# EAGLE design ardio_st32f205r (EAGLE 5.11)
MFR: Abracon; MFR_PART: ABLS-25.000MHZ-B4-F-T

## Sheet 1 of 3
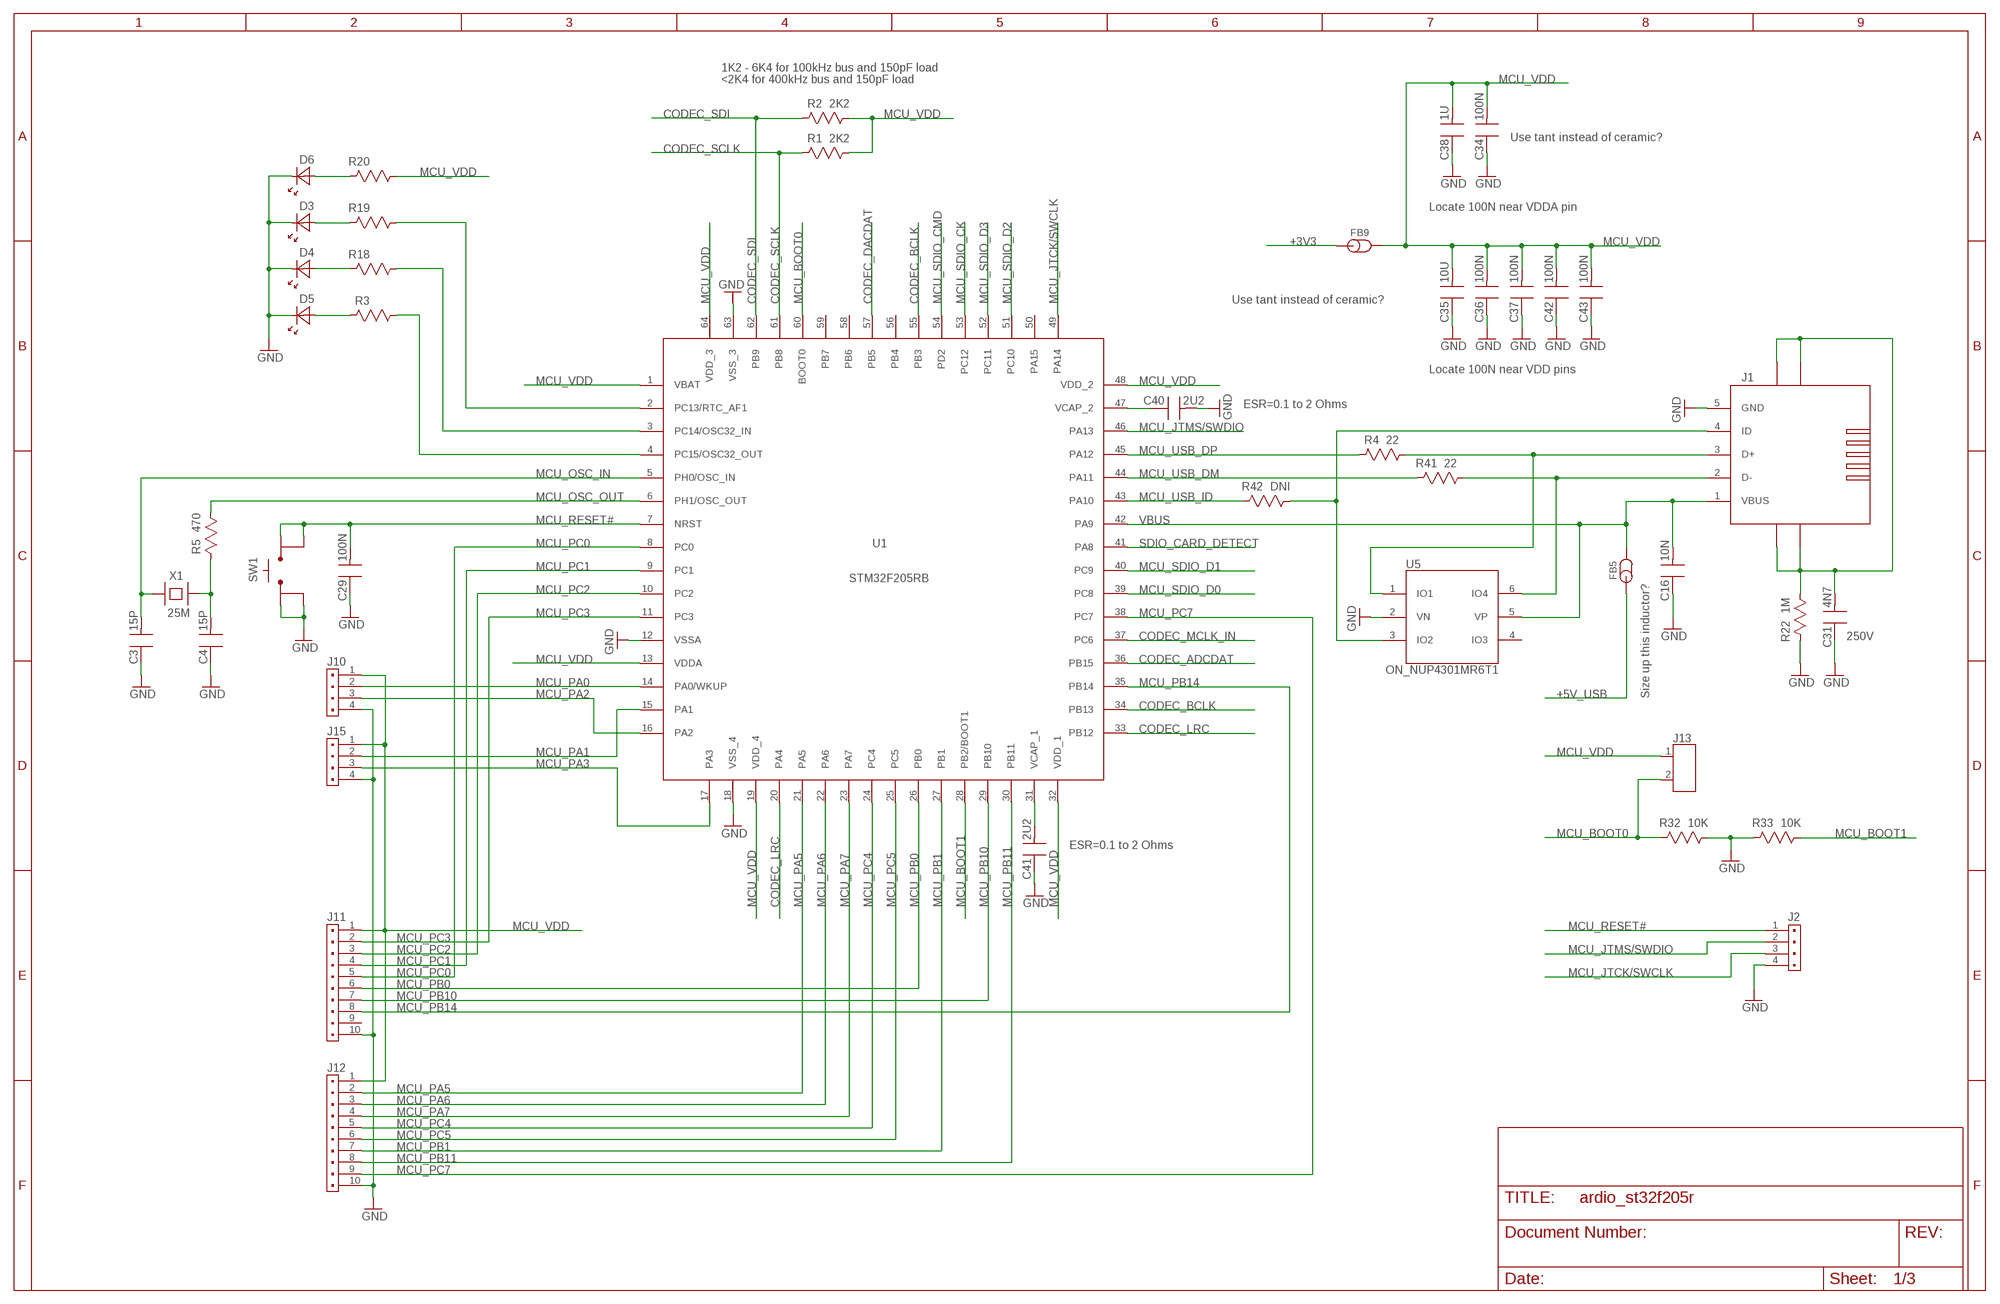
[diagram p0: schematic, sheet 1]

### Parts
C3  15P  C0603_90  [CAPC1608X90N]
C4  15P  C0603_90  [CAPC1608X90N]
C16  10N  C0603_90  [CAPC1608X90N]
C29  100N  C0603_90  [CAPC1608X90N]
C31  4N7  C0603_90  [CAPC1608X90N]
C34  100N  C0603_90  [CAPC1608X90N]
C35  10U  C0805_135  [CAPC2012X135N]
C36  100N  C0603_90  [CAPC1608X90N]
C37  100N  C0603_90  [CAPC1608X90N]
C38  1U  C0603_90  [CAPC1608X90N]
C40  2U2  C0805_135  [CAPC2012X135N]
C41  2U2  C0805_135  [CAPC2012X135N]
C42  100N  C0603_90  [CAPC1608X90N]
C43  100N  C0603_90  [CAPC1608X90N]
D3  LED_0603  [LEDC1608X80N]
D4  LED_0603  [LEDC1608X80N]
D5  LED_0603  [LEDC1608X80N]
D6  LED_0603  [LEDC1608X80N]
FB5  FB0603  [INDC1608X95N]
FB9  FB0603  [INDC1608X95N]
J1  USB_MINI_B_HIROSE_UX60_MB_5ST  [HIROSE_UX60_MB_5ST]
J2  HEADER1X4  HEADER1X4TH-254  [HEADER254P1X4]
J10  HEADER1X4TH-254  [HEADER254P1X4]
J11  HEADER1X10TH-254  [HEADER254P1X10]
J12  HEADER1X10TH-254  [HEADER254P1X10]
J13  CON2_100MIL  CON2TH-254  [HEADER254P1X2]
J15  HEADER1X4TH-254  [HEADER254P1X4]
R1  2K2  R0603_55  [RESC1608X55N]
R2  2K2  R0603_55  [RESC1608X55N]
R3  R0603_55  [RESC1608X55N]
R4  22  R0603_55  [RESC1608X55N]
R5  470  R0603_55  [RESC1608X55N]
R18  R0603_55  [RESC1608X55N]
R19  R0603_55  [RESC1608X55N]
R20  R0603_55  [RESC1608X55N]
R22  1M  R0603_55  [RESC1608X55N]
R32  10K  R0603_55  [RESC1608X55N]
R33  10K  R0603_55  [RESC1608X55N]
R41  22  R0603_55  [RESC1608X55N]
R42  DNI  R0603_55  [RESC1608X55N]
SW1  SPST_NO_4PIN  [6X6_SMD]
U1  STM32F205RB  [QFP50P1200X1200X160-64N]
U5  ON_NUP4301MR6T1  [SOP95P275X110-6N]
X1  25M  X_HC49US  [HC-49/U-S]

### Nets
+3V3: FB9.1 ; also sheet 2,3
+5V_USB: FB5.1 ; also sheet 2
CODEC_ADCDAT: U1.36(PB15) ; also sheet 3
CODEC_BCLK: U1.34(PB13) U1.55(PB3) ; also sheet 3
CODEC_DACDAT: U1.57(PB5) ; also sheet 3
CODEC_LRC: U1.20(PA4) U1.33(PB12) ; also sheet 3
CODEC_MCLK_IN: U1.37(PC6) ; also sheet 3
CODEC_SCLK: R1.1 U1.61(PB8) ; also sheet 3
CODEC_SDI: R2.1 U1.62(PB9) ; also sheet 3
GND: C3.1 C4.1 C16.1 C29.1 C31.1 C34.1 C35.1 C36.1 C37.1 C38.1 C40.2 C41.1 C42.1 C43.1 D3.C D4.C D5.C D6.C J1.5(GND) J2.4 J10.4 J11.10 J12.10 J15.4 R22.1 R32.2 R33.1 SW1.1 SW1.2 U1.12(VSSA) U1.18(VSS_4) U1.63(VSS_3) U5.2(VN) ; also sheet 2,3
MCU_BOOT0: J13.2 R32.1 U1.60(BOOT0)
MCU_BOOT1: R33.2 U1.28(PB2/BOOT1)
MCU_JTCK/SWCLK: J2.3 U1.49(PA14)
MCU_JTMS/SWDIO: J2.2 U1.46(PA13)
MCU_OSC_IN: C3.2 U1.5(PH0/OSC_IN) X1.1
MCU_OSC_OUT: R5.2 U1.6(PH1/OSC_OUT)
MCU_PA0: J10.2 U1.14(PA0/WKUP)
MCU_PA1: J15.2 U1.15(PA1)
MCU_PA2: J10.3 U1.16(PA2)
MCU_PA3: J15.3 U1.17(PA3)
MCU_PA5: J12.2 U1.21(PA5)
MCU_PA6: J12.3 U1.22(PA6)
MCU_PA7: J12.4 U1.23(PA7)
MCU_PB0: J11.6 U1.26(PB0)
MCU_PB1: J12.7 U1.27(PB1)
MCU_PB10: J11.7 U1.29(PB10)
MCU_PB11: J12.8 U1.30(PB11)
MCU_PB14: J11.8 U1.35(PB14)
MCU_PC0: J11.5 U1.8(PC0)
MCU_PC1: J11.4 U1.9(PC1)
MCU_PC2: J11.3 U1.10(PC2)
MCU_PC3: J11.2 U1.11(PC3)
MCU_PC4: J12.5 U1.24(PC4)
MCU_PC5: J12.6 U1.25(PC5)
MCU_PC7: J12.9 U1.38(PC7)
MCU_RESET#: C29.2 J2.1 SW1.3 SW1.4 U1.7(NRST)
MCU_SDIO_CK: U1.53(PC12) ; also sheet 2
MCU_SDIO_CMD: U1.54(PD2) ; also sheet 2
MCU_SDIO_D0: U1.39(PC8) ; also sheet 2
MCU_SDIO_D1: U1.40(PC9) ; also sheet 2
MCU_SDIO_D2: U1.51(PC10) ; also sheet 2
MCU_SDIO_D3: U1.52(PC11) ; also sheet 2
MCU_USB_DM: R41.1 U1.44(PA11)
MCU_USB_DP: R4.1 U1.45(PA12)
MCU_USB_ID: R42.1 U1.43(PA10)
MCU_VDD: C34.2 C35.2 C36.2 C37.2 C38.2 C42.2 C43.2 FB9.2 J10.1 J11.1 J12.1 J13.1 J15.1 R1.2 R2.2 R20.2 U1.1(VBAT) U1.13(VDDA) U1.19(VDD_4) U1.32(VDD_1) U1.48(VDD_2) U1.64(VDD_3) ; also sheet 2
N$1: R3.2 U1.4(PC15/OSC32_OUT)
N$2: R18.2 U1.3(PC14/OSC32_IN)
N$3: R19.2 U1.2(PC13/RTC_AF1)
N$7: D3.A R19.1
N$10: C4.2 R5.1 X1.2
N$11: J1.2(D-) R41.2 U5.6(IO4)
N$13: D4.A R18.1
N$14: D5.A R3.1
N$15: J1.3(D+) R4.2 U5.1(IO1)
N$16: C40.1 U1.47(VCAP_2)
N$17: D6.A R20.1
N$23: C41.2 U1.31(VCAP_1)
SDIO_CARD_DETECT: U1.41(PA8) ; also sheet 2
USB_ID: J1.4(ID) R42.2 U5.3(IO2)
USB_SHIELD: C31.2 J1.SHIELD@1(SHIELD) J1.SHIELD@2(SHIELD) J1.SHIELD@3(SHIELD) J1.SHIELD@4(SHIELD) R22.2
VBUS: C16.2 FB5.2 J1.1(VBUS) U1.42(PA9) U5.5(VP)
Unconnected: J11.9 U1.50(PA15) U1.56(PB4) U1.58(PB6) U1.59(PB7) U5.4(IO3)

### Notes on the sheet
- 1K2 - 6K4 for 100kHz bus and 150pF load
- <2K4 for 400kHz bus and 150pF load
- Use tant instead of ceramic?
- Locate 100N near VDDA pin
- Use tant instead of ceramic?
- Locate 100N near VDD pins
- ESR=0.1 to 2 Ohms
- 250V
- Size up this inductor?
- ESR=0.1 to 2 Ohms

## Sheet 2 of 3
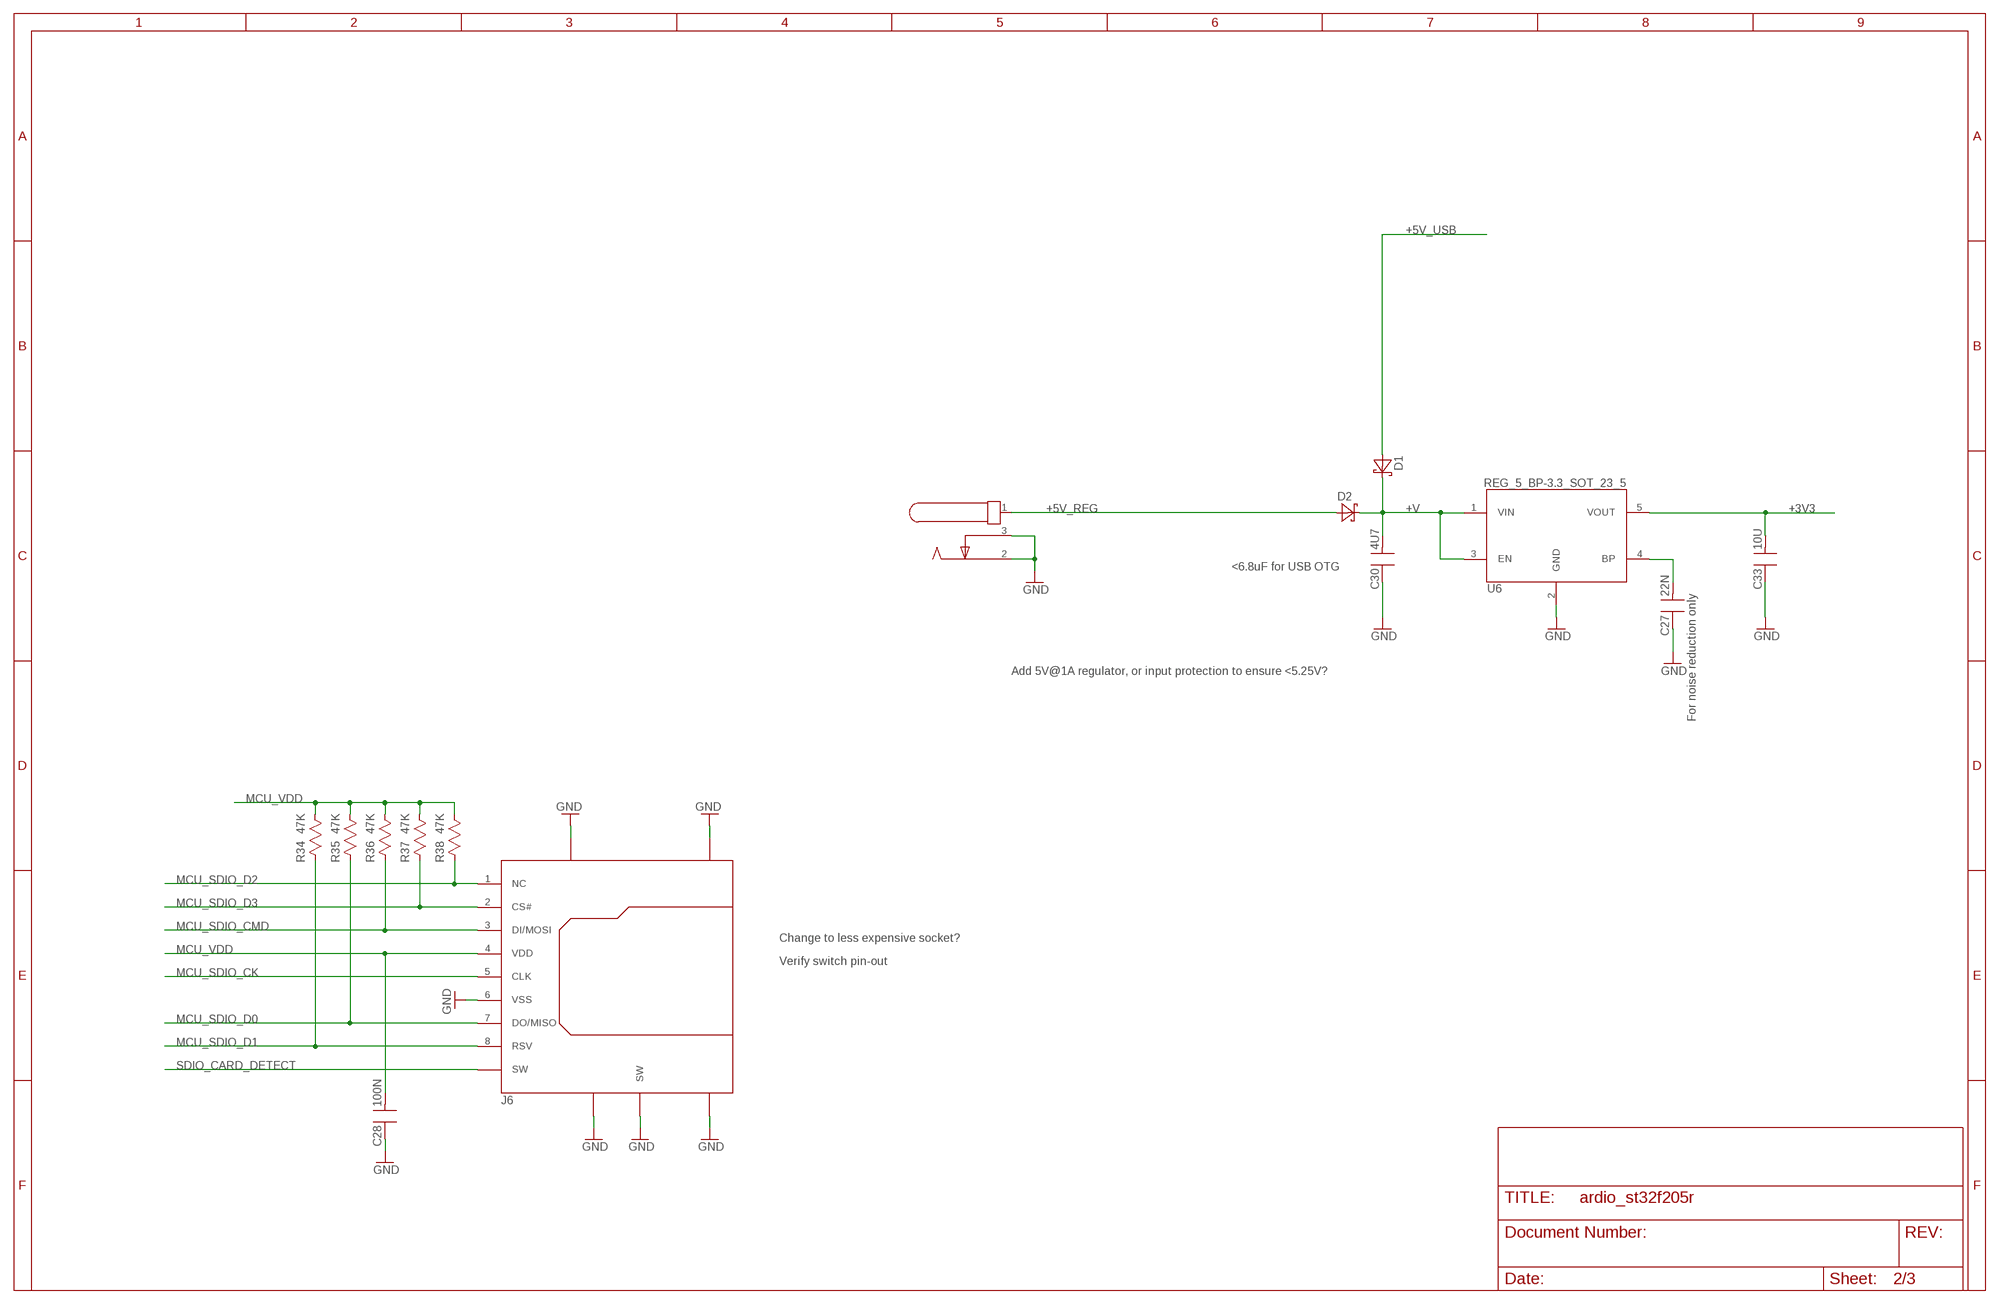
[diagram p1: schematic, sheet 2]

### Parts
C27  22N  C0603_90  [CAPC1608X90N]
C28  100N  C0603_90  [CAPC1608X90N]
C30  4U7  C0805_135  [CAPC2012X135N]
C33  10U  C0805_135  [CAPC2012X135N]
D1  SCHOTTKY_SMA  [DIOM5027X244N]
D2  SCHOTTKY_SMA  [DIOM5027X244N]
J6  MICROSD_SPI_DM3AT  [DM3AT]
J7  DC_3_CUI_PJ102A  [CUI_PJ_102A]
R34  47K  R0603_55  [RESC1608X55N]
R35  47K  R0603_55  [RESC1608X55N]
R36  47K  R0603_55  [RESC1608X55N]
R37  47K  R0603_55  [RESC1608X55N]
R38  47K  R0603_55  [RESC1608X55N]
U6  REG_5_BP-3.3_SOT_23_5  [SOT95P280X110-5N]

### Nets
+3V3: C33.2 U6.5(VOUT) ; also sheet 1,3
+5V_REG: D2.A J7.1
+5V_USB: D1.A ; also sheet 1
+V: C30.2 D1.C D2.C U6.1(VIN) U6.3(EN)
GND: C27.1 C28.1 C30.1 C33.1 J6.6(VSS) J6.SHIELD@1(SHIELD) J6.SHIELD@3(SHIELD) J6.SHIELD@4(SHIELD) J6.SHIELD@5(SHIELD) J6.SW@2(SW) J7.2 J7.3 U6.2(GND) ; also sheet 1,3
MCU_SDIO_CK: J6.5(CLK) ; also sheet 1
MCU_SDIO_CMD: J6.3(DI/MOSI) R36.1 ; also sheet 1
MCU_SDIO_D0: J6.7(DO/MISO) R35.1 ; also sheet 1
MCU_SDIO_D1: J6.8(RSV) R34.1 ; also sheet 1
MCU_SDIO_D2: J6.1(NC) R38.1 ; also sheet 1
MCU_SDIO_D3: J6.2(CS#) R37.1 ; also sheet 1
MCU_VDD: C28.2 J6.4(VDD) R34.2 R35.2 R36.2 R37.2 R38.2 ; also sheet 1
N$6: C27.2 U6.4(BP)
SDIO_CARD_DETECT: J6.SW@1(SW) ; also sheet 1

### Notes on the sheet
- <6.8uF for USB OTG
- Add 5V@1A regulator, or input protection to ensure <5.25V?
- For noise reduction only
- Change to less expensive socket?
- Verify switch pin-out

## Sheet 3 of 3
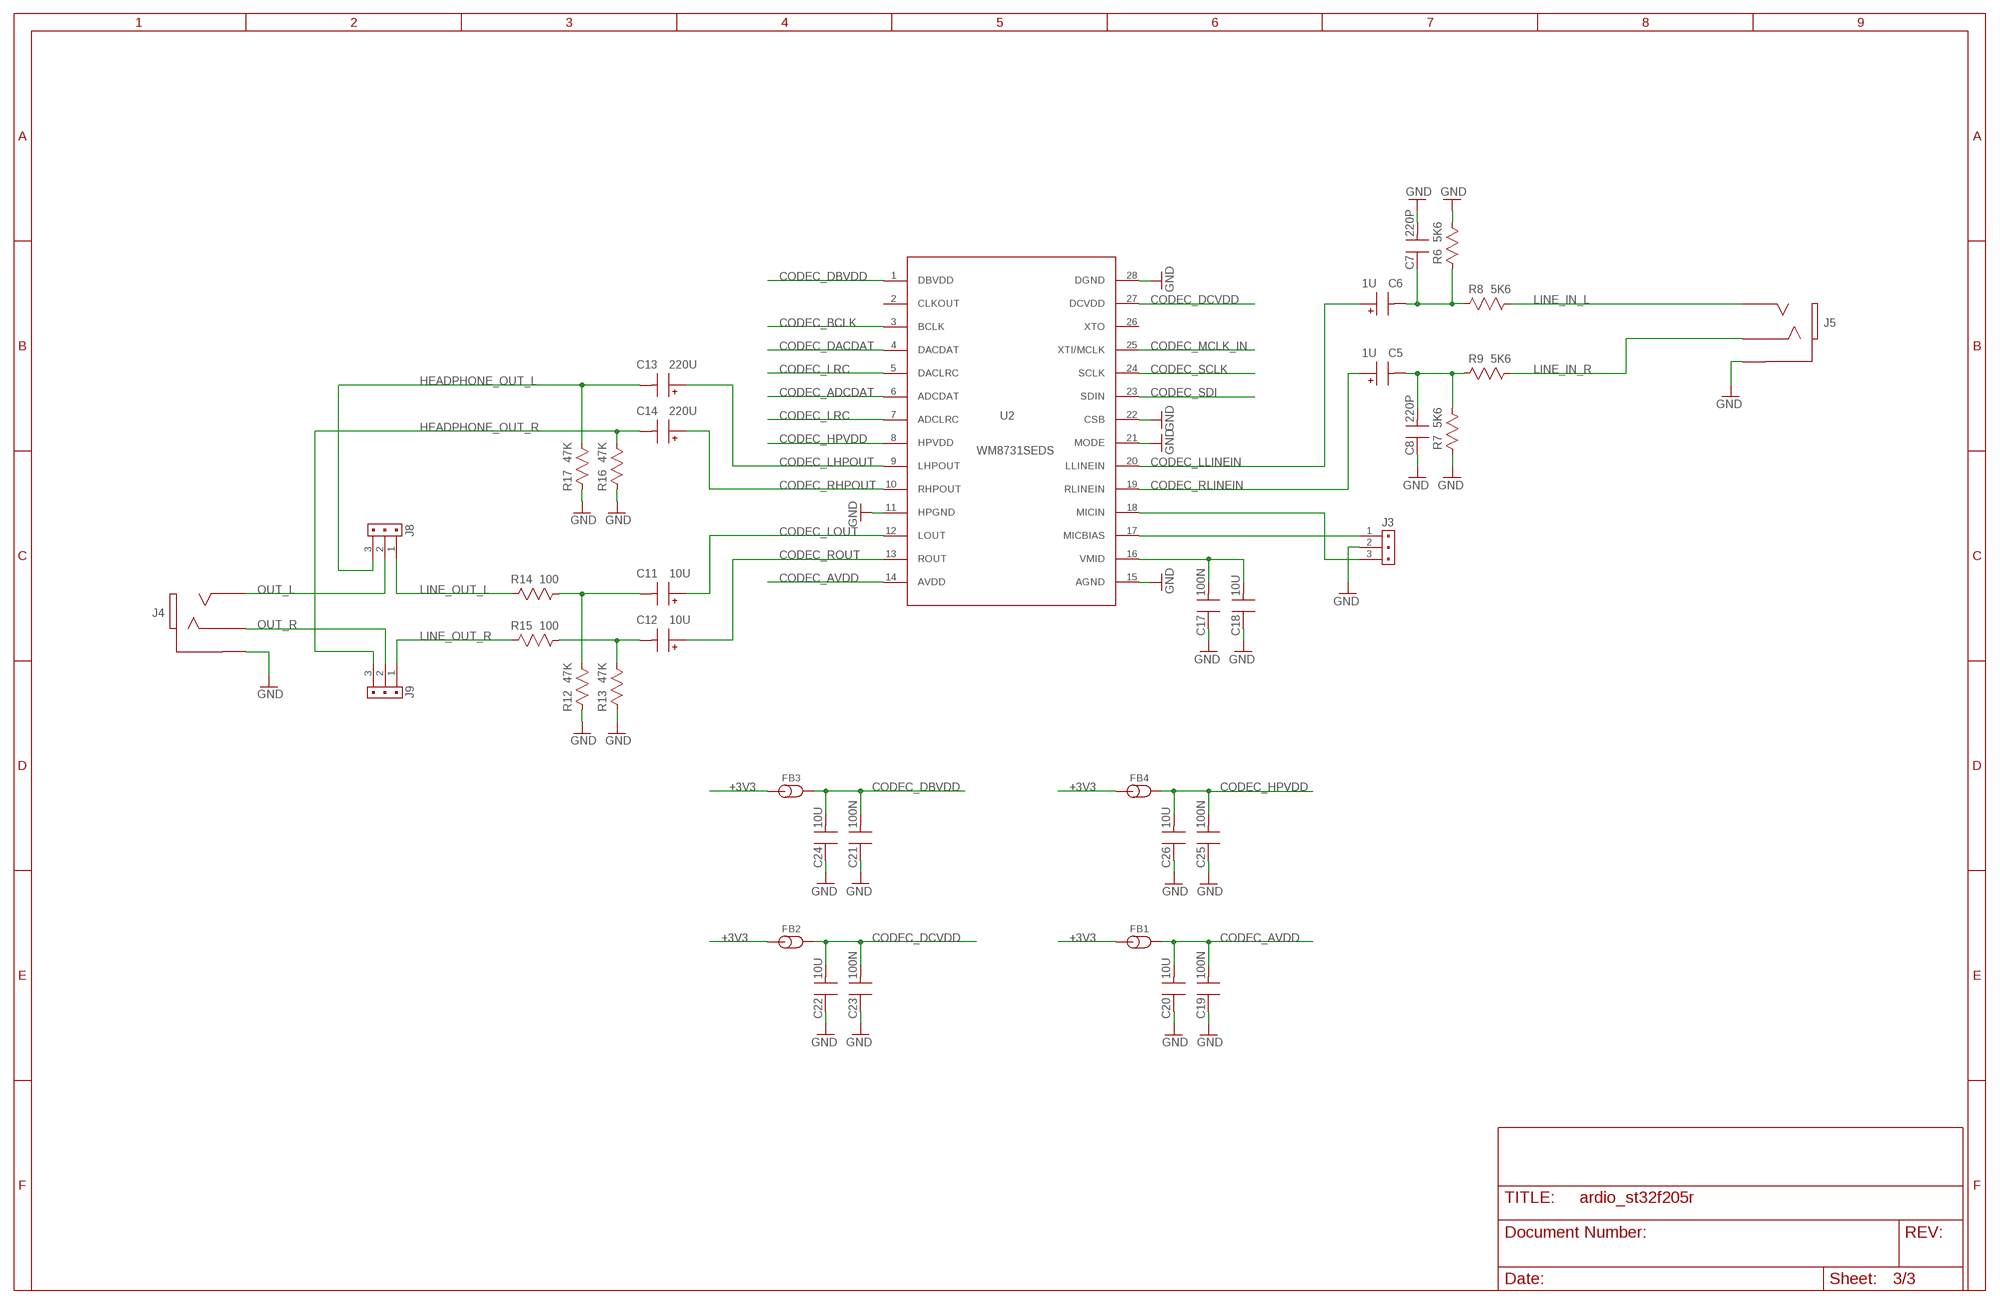
[diagram p2: schematic, sheet 3]

### Parts
C5  1U  CPOL_CASE_B  [CAPAE430X540N]
C6  1U  CPOL_CASE_B  [CAPAE430X540N]
C7  220P  C0603_90  [CAPC1608X90N]
C8  220P  C0603_90  [CAPC1608X90N]
C11  10U  CPOL_CASE_C  [CAPAE530X540N]
C12  10U  CPOL_CASE_C  [CAPAE530X540N]
C13  220U  CPOL_CASE_E  [CAPAE830X620N]
C14  220U  CPOL_CASE_E  [CAPAE830X620N]
C17  100N  C0603_90  [CAPC1608X90N]
C18  10U  C0805_135  [CAPC2012X135N]
C19  100N  C0603_90  [CAPC1608X90N]
C20  10U  C0805_135  [CAPC2012X135N]
C21  100N  C0603_90  [CAPC1608X90N]
C22  10U  C0805_135  [CAPC2012X135N]
C23  100N  C0603_90  [CAPC1608X90N]
C24  10U  C0805_135  [CAPC2012X135N]
C25  100N  C0603_90  [CAPC1608X90N]
C26  10U  C0805_135  [CAPC2012X135N]
FB1  FB0603  [INDC1608X95N]
FB2  FB0603  [INDC1608X95N]
FB3  FB0603  [INDC1608X95N]
FB4  FB0603  [INDC1608X95N]
J3  HEADER1X3TH-254  [HEADER254P1X3]
J4  STEREO_JACK_CUI_SJ_3523_SMT  [CUI_SJ-3523-SMT]
J5  STEREO_JACK_CUI_SJ_3523_SMT  [CUI_SJ-3523-SMT]
J8  HEADER1X3TH-254  [HEADER254P1X3]
J9  HEADER1X3TH-254  [HEADER254P1X3]
R6  5K6  R0603_55  [RESC1608X55N]
R7  5K6  R0603_55  [RESC1608X55N]
R8  5K6  R0603_55  [RESC1608X55N]
R9  5K6  R0603_55  [RESC1608X55N]
R12  47K  R0603_55  [RESC1608X55N]
R13  47K  R0603_55  [RESC1608X55N]
R14  100  R0603_55  [RESC1608X55N]
R15  100  R0603_55  [RESC1608X55N]
R16  47K  R0603_55  [RESC1608X55N]
R17  47K  R0603_55  [RESC1608X55N]
U2  WM8731SEDS  [DS28]

### Nets
+3V3: FB1.1 FB2.1 FB3.1 FB4.1 ; also sheet 1,2
CODEC_ADCDAT: U2.6(ADCDAT) ; also sheet 1
CODEC_AVDD: C19.2 C20.2 FB1.2 U2.14(AVDD)
CODEC_BCLK: U2.3(BCLK) ; also sheet 1
CODEC_DACDAT: U2.4(DACDAT) ; also sheet 1
CODEC_DBVDD: C21.2 C24.2 FB3.2 U2.1(DBVDD)
CODEC_DCVDD: C22.2 C23.2 FB2.2 U2.27(DCVDD)
CODEC_HPVDD: C25.2 C26.2 FB4.2 U2.8(HPVDD)
CODEC_LHPOUT: C13.1 U2.9(LHPOUT)
CODEC_LLINEIN: C6.1 U2.20(LLINEIN)
CODEC_LOUT: C11.1 U2.12(LOUT)
CODEC_LRC: U2.5(DACLRC) U2.7(ADCLRC) ; also sheet 1
CODEC_MCLK_IN: U2.25(XTI/MCLK) ; also sheet 1
CODEC_RHPOUT: C14.1 U2.10(RHPOUT)
CODEC_RLINEIN: C5.1 U2.19(RLINEIN)
CODEC_ROUT: C12.1 U2.13(ROUT)
CODEC_SCLK: U2.24(SCLK) ; also sheet 1
CODEC_SDI: U2.23(SDIN) ; also sheet 1
GND: C7.2 C8.1 C17.1 C18.1 C19.1 C20.1 C21.1 C22.1 C23.1 C24.1 C25.1 C26.1 J3.2 J4.1 J5.1 R6.2 R7.1 R12.1 R13.1 R16.1 R17.1 U2.11(HPGND) U2.15(AGND) U2.21(MODE) U2.22(CSB) U2.28(DGND) ; also sheet 1,2
HEADPHONE_OUT_L: C13.2 J8.3 R17.2
HEADPHONE_OUT_R: C14.2 J9.3 R16.2
LINE_IN_L: J5.2 R8.2
LINE_IN_R: J5.3 R9.2
LINE_OUT_L: J8.1 R14.1
LINE_OUT_R: J9.1 R15.1
N$9: J3.1 U2.17(MICBIAS)
N$18: J3.3 U2.18(MICIN)
N$20: C5.2 C8.2 R7.2 R9.1
N$21: C6.2 C7.1 R6.1 R8.1
N$29: C11.2 R12.2 R14.2
N$30: C12.2 R13.2 R15.2
N$41: C17.2 C18.2 U2.16(VMID)
OUT_L: J4.2 J8.2
OUT_R: J4.3 J9.2
Unconnected: U2.2(CLKOUT) U2.26(XTO)

## Library data of the parts
C3 C4 C7 C8 C16-C31 C33-C38 C40-C43 = capacitor:C
C5 C6 C11-C14 = capacitor:CPOL
D1 D2 = diode:SCHOTTKY
D3-D6 = led:LED
FB1-FB5 FB9 = inductor:FB
J1 = usb:USB_MINI_B
J2 J10 J15 = stake:HEADER1X4
J3 J8 J9 = stake:HEADER1X3
J4 J5 = audio_connector:STEREO_JACK
J6 = hirose:MICROSD_SPI
J7 = dc_connector:DC_3
J11 J12 = stake:HEADER1X10
J13 = stake:CON2
R1-R9 R12-R20 R22 R32-R38 R41 R42 = resistor:R
SW1 = switch:SPST_NO_4PIN
U1 = st:STM32F205?*
U2 = wolfson:WM8731SEDS
U5 = usb:ON_NUP4301MR6T1: Pin-compatible with several devices, including NXP IP4220CZ6
U6 = regulator:REG_5_BP-*
X1 = crystal:X

## Board
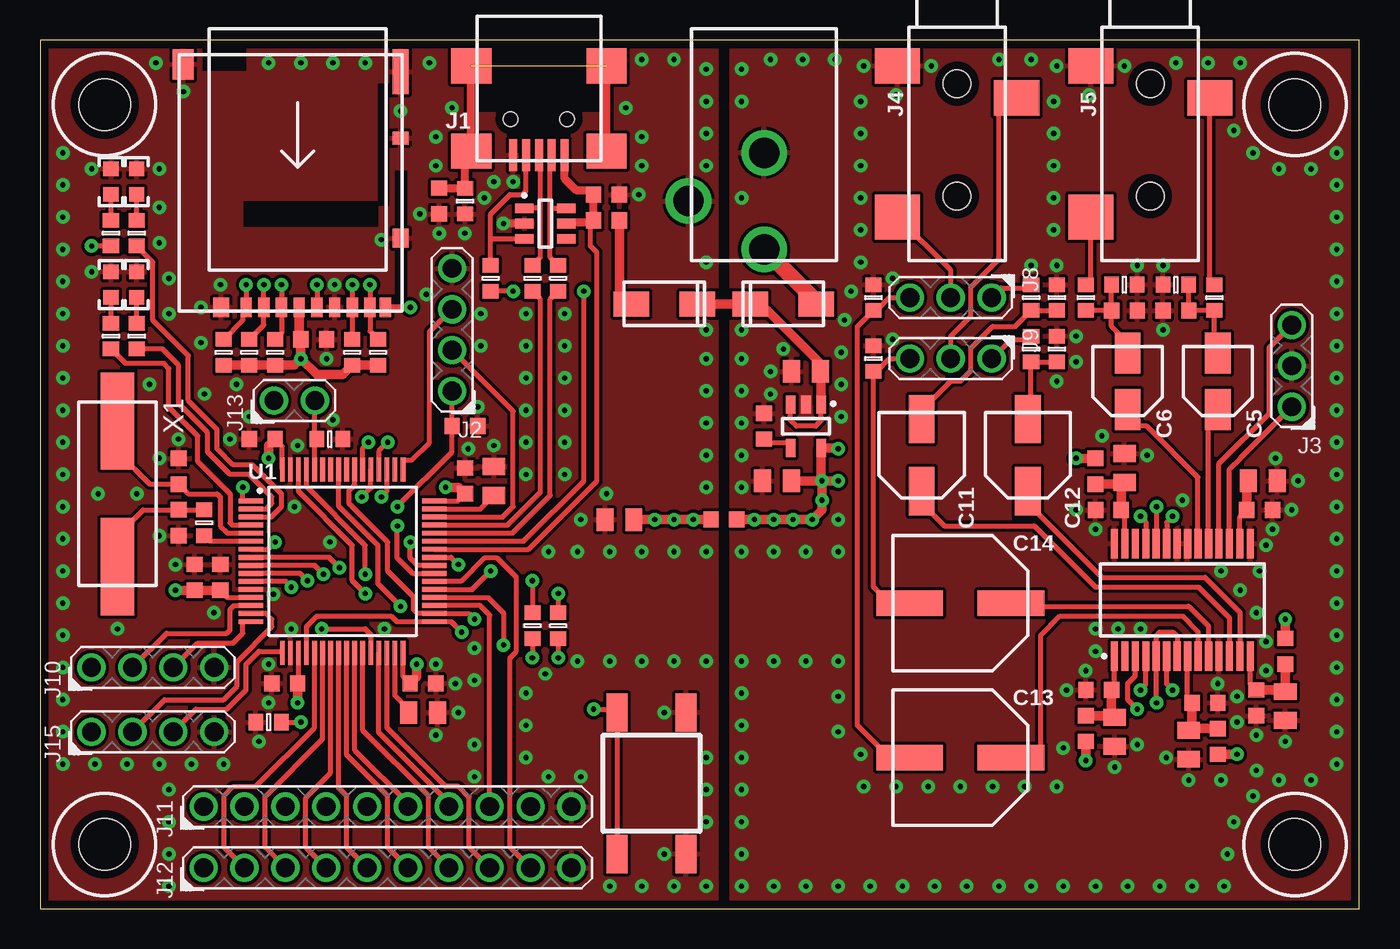
[diagram p3: board, top side]
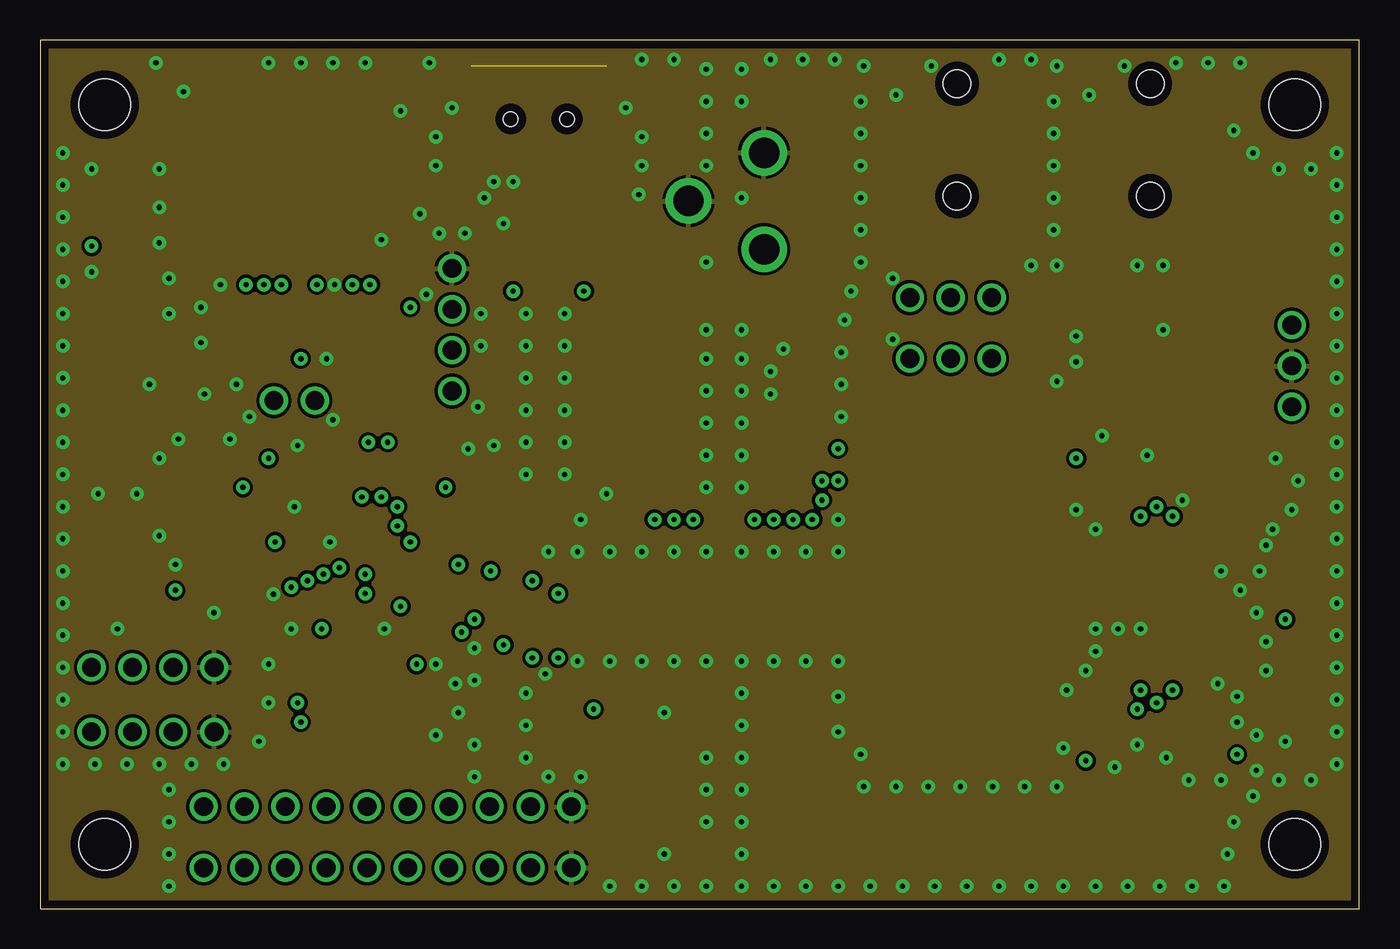
[diagram p4: board, inner layer Route2]
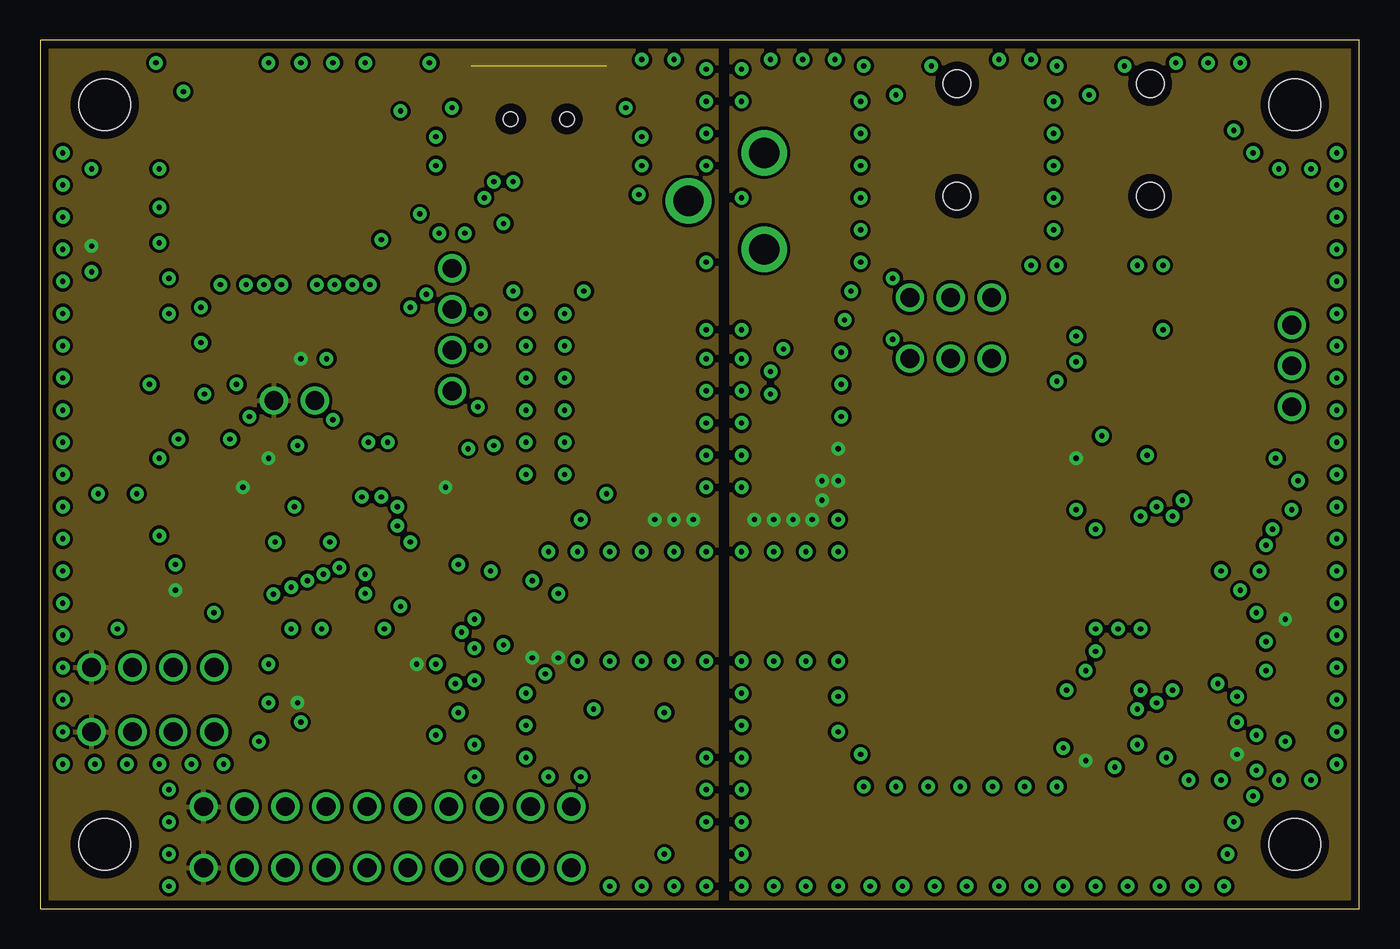
[diagram p5: board, inner layer Route15]
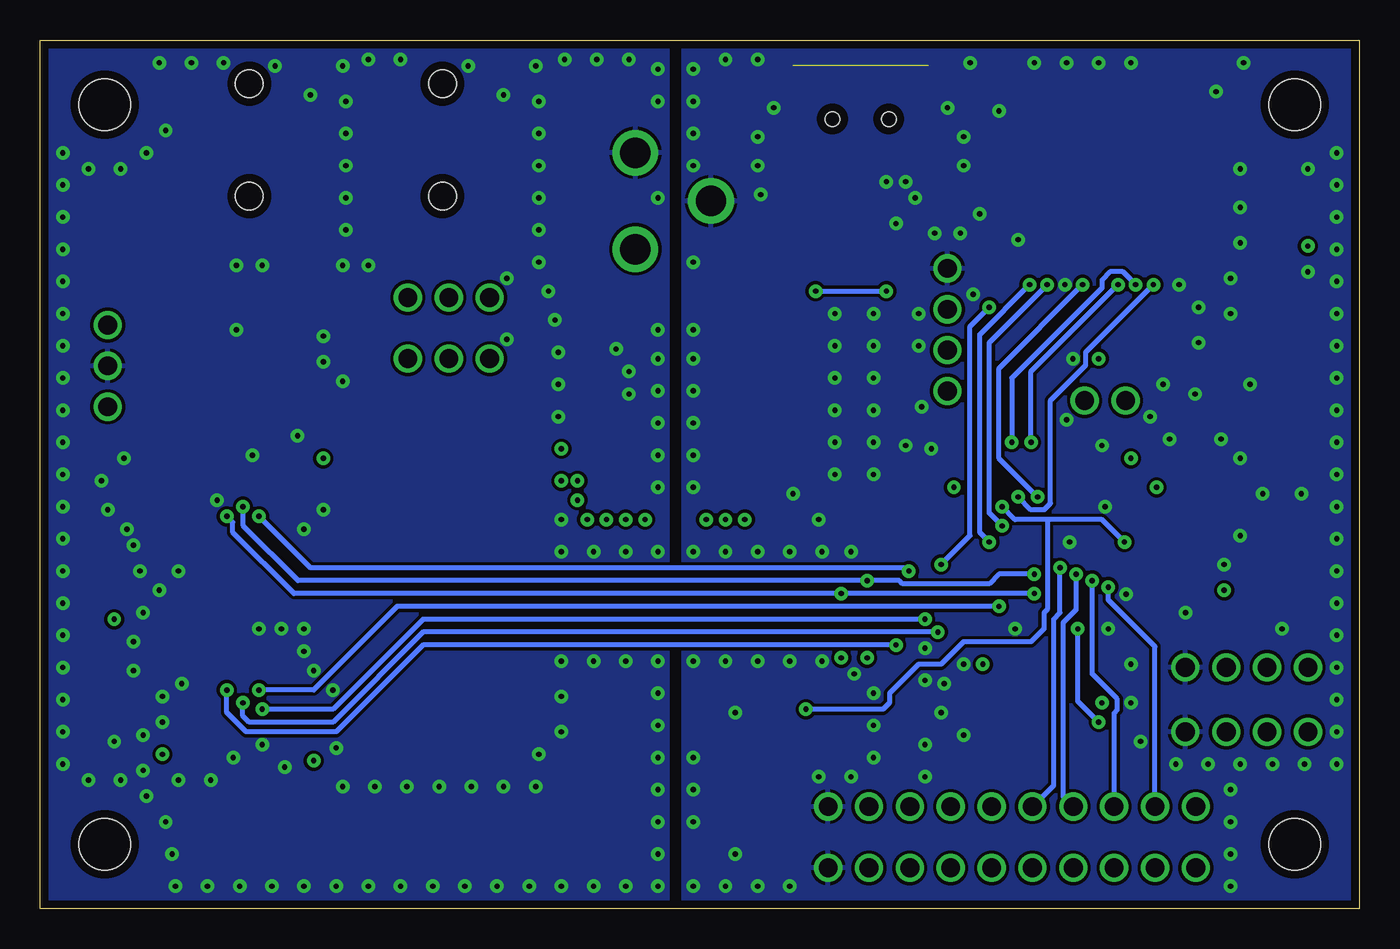
[diagram p6: board, bottom side, seen from below]

Size 82 x 54 mm. Coordinates in mm from the lower left corner, seen from the top.
Outline: 0,0 82,0 82,54 0,54 0,0
Copper layers (1+2*15+16): Top 0.0178mm / dielectric 0.3048mm / Route2 0.0356mm / dielectric 0.7112mm / Route15 0.0356mm / dielectric 0.3048mm / Bottom 0.0178mm
Design rules "st32f205r_breakout *": minimum track width 0.25mm, minimum drill 13mil, track to track 0.2mm, track to pad 0.2mm, pad to pad 0.2mm, via to via 0.2mm, smd to smd 0.2mm, copper to edge 20mil, drill to drill 16mil, minimum pad ring 10mil, minimum via ring 10mil, stop-mask expansion 3mil, vias tented up to drill 13mil, thermal gap 8mil
Holes 3.2 mm at 4,50 4,4 78,4 78,50

### Footprints (pad centres in the part's own frame; a part is rotated, then mirrored left to right if it is on the bottom)
CAPC1608X90N = smd 0.95 x 1: 1 -0.8,0; 2 0.8,0
CAPAE430X540N = smd 2.55 x 1.6: 1 -1.75,0; 2 1.75,0
CAPAE530X540N = smd 3 x 1.6: 1 -2.25,0; 2 2.25,0
CAPAE830X620N = smd 4.15 x 1.6: 1 -3.15,0; 2 3.15,0
CAPC2012X135N = smd 1.05 x 1.4: 1 -0.9,0; 2 0.9,0
DIOM5027X244N = smd 2.2 x 1.55: A 2.05,0; C -2.05,0
LEDC1608X80N = smd 0.9 x 0.95: A 0.8,0; C -0.8,0
INDC1608X95N = smd 0.95 x 1: 1 -0.8,0; 2 0.8,0
HIROSE_UX60_MB_5ST = smd 0.5 x 2: 1 -1.6,4.15; 2 -0.8,4.15; 3 0,4.15; 4 0.8,4.15; 5 1.6,4.15 | smd 2.5 x 2.2: SHIELD@1 -4.2,-1.4; SHIELD@2 -4.2,3.9; SHIELD@3 4.2,-1.4; SHIELD@4 4.2,3.9 | hole 0.9: -1.75,1.9; 1.75,1.9
HEADER254P1X4 = drill 1.168 round: 1 0,3.81; 2 0,1.27; 3 0,-1.27; 4 0,-3.81
HEADER254P1X3 = drill 1.168 round: 1 0,2.54; 2 0,0; 3 0,-2.54
CUI_SJ-3523-SMT = smd 2.2 x 2.8: 1 -3.6,-3.7; 3 -1.6,3.7 | smd 2.8 x 2.8: 2 5.8,-3.7 | hole 1.7: -2.5,0; 4.5,0
DM3AT = smd 0.7 x 1.2: 1 0,0.6; 2 -1.1,0.6; 3 -2.2,0.6; 4 -3.3,0.6; 5 -4.4,0.6; 6 -5.5,0.6; 7 -6.6,0.6; 8 -7.7,0.6; SW@1 -8.65,0.6 | smd 1 x 2.8: SHIELD@1 -9.6,-14.05 | smd 1 x 1.2: SHIELD@3 -9.6,-3.7; SHIELD@4 1.55,0.6 | smd 1.3 x 1.9: SHIELD@5 3.9,-14.5 | smd 1 x 0.8: SW@2 -9.6,-9.9
CUI_PJ_102A = drill 1.887 round: 1 0,-3; 2 0,3; 3 -4.7,0
HEADER254P1X10 = drill 1.168 round: 1 0,11.43; 2 0,8.89; 3 0,6.35; 4 0,3.81; 5 0,1.27; 6 0,-1.27; 7 0,-3.81; 8 0,-6.35; 9 0,-8.89; 10 0,-11.43
HEADER254P1X2 = drill 1.168 round: 1 0,1.27; 2 0,-1.27
RESC1608X55N = smd 0.9 x 1: 1 -0.8,0; 2 0.8,0
6X6_SMD = smd 2.4 x 1.3: 1 -4.4,2.15; 2 4.4,2.15; 3 -4.4,-2.15; 4 4.4,-2.15
QFP50P1200X1200X160-64N = smd 1.5 x 0.3: 1 -5.7,3.75; 2 -5.7,3.25; 3 -5.7,2.75; 4 -5.7,2.25; 5 -5.7,1.75; 6 -5.7,1.25; 7 -5.7,0.75; 8 -5.7,0.25; 9 -5.7,-0.25; 10 -5.7,-0.75; 11 -5.7,-1.25; 12 -5.7,-1.75; 13 -5.7,-2.25; 14 -5.7,-2.75; 15 -5.7,-3.25; 16 -5.7,-3.75; 33 5.7,-3.75; 34 5.7,-3.25; 35 5.7,-2.75; 36 5.7,-2.25; 37 5.7,-1.75; 38 5.7,-1.25; 39 5.7,-0.75; 40 5.7,-0.25; 41 5.7,0.25; 42 5.7,0.75; 43 5.7,1.25; 44 5.7,1.75; 45 5.7,2.25; 46 5.7,2.75; 47 5.7,3.25; 48 5.7,3.75 | smd 0.3 x 1.5: 17 -3.75,-5.7; 18 -3.25,-5.7; 19 -2.75,-5.7; 20 -2.25,-5.7; 21 -1.75,-5.7; 22 -1.25,-5.7; 23 -0.75,-5.7; 24 -0.25,-5.7; 25 0.25,-5.7; 26 0.75,-5.7; 27 1.25,-5.7; 28 1.75,-5.7; 29 2.25,-5.7; 30 2.75,-5.7; 31 3.25,-5.7; 32 3.75,-5.7; 49 3.75,5.7; 50 3.25,5.7; 51 2.75,5.7; 52 2.25,5.7; 53 1.75,5.7; 54 1.25,5.7; 55 0.75,5.7; 56 0.25,5.7; 57 -0.25,5.7; 58 -0.75,5.7; 59 -1.25,5.7; 60 -1.75,5.7; 61 -2.25,5.7; 62 -2.75,5.7; 63 -3.25,5.7; 64 -3.75,5.7
DS28 = smd 1.85 x 0.45: 1 -3.5,4.225; 2 -3.5,3.575; 3 -3.5,2.925; 4 -3.5,2.275; 5 -3.5,1.625; 6 -3.5,0.975; 7 -3.5,0.325; 8 -3.5,-0.325; 9 -3.5,-0.975; 10 -3.5,-1.625; 11 -3.5,-2.275; 12 -3.5,-2.925; 13 -3.5,-3.575; 14 -3.5,-4.225; 15 3.5,-4.225; 16 3.5,-3.575; 17 3.5,-2.925; 18 3.5,-2.275; 19 3.5,-1.625; 20 3.5,-0.975; 21 3.5,-0.325; 22 3.5,0.325; 23 3.5,0.975; 24 3.5,1.625; 25 3.5,2.275; 26 3.5,2.925; 27 3.5,3.575; 28 3.5,4.225
SOP95P275X110-6N = smd 1.15 x 0.6: 1 -1.3,0.95; 2 -1.3,0; 3 -1.3,-0.95; 4 1.3,-0.95; 5 1.3,0; 6 1.3,0.95
SOT95P280X110-5N = smd 1.1 x 0.6: 1 -1.35,0.95; 2 -1.35,0; 3 -1.35,-0.95; 4 1.35,-0.95; 5 1.35,0.95
HC-49/U-S = smd 6.05 x 2.1: 1 -4.525,0; 2 4.525,0

### Placement (x,y rotation side)
C3  8.6,27.2 270 top
C4  8.6,24 90 top
C5  73.2,32.8 90 top
C6  67.6,32.8 90 top
C7  67.4,37.2 0 top
C8  70.6,37.2 0 top
C11  54.8,28.2 90 top
C12  61.4,28.2 90 top
C13  57.2,9.4 180 top
C14  57.2,19 180 top
C16  35.2,44.4 180 top
C17  75.8,24.8 180 top
C18  76,26.6 180 top
C19  75.6,12.8 90 top
C20  77.4,12.6 90 top
C21  65.8,13.6 0 top
C22  67.4,27.4 270 top
C23  66.4,24.8 0 top
C24  66.8,11 90 top
C25  72.4,12.8 180 top
C26  71.4,10.2 90 top
C27  45,30 270 top
C28  17,35.4 180 top
C29  26.4,30 180 top
C30  47.6,33.4 0 top
C31  24.8,44 90 top
C33  45.8,26.6 0 top
C34  11.2,20.6 270 top
C35  36,24.2 0 top
C36  15.2,14 0 top
C37  23.8,14 180 top
C38  9.6,20.6 270 top
C40  28.2,26.6 90 top
C41  23.8,12.2 180 top
C42  26.4,26.6 270 top
C43  13.8,29.2 0 top
D1  38.8,37.6 180 top
D2  46.2,37.6 0 top
D3  6,38.8 270 top
D4  6,45.2 270 top
D5  4.4,38.8 270 top
D6  4.4,45.2 270 top
FB1  77.4,16 270 top
FB2  65.6,27.2 270 top
FB3  65,11.2 90 top
FB4  73.2,10.4 90 top
FB5  35.2,42.8 180 top
FB9  42.5,24.2 180 top
J1  31,51 180 top
J2  25.6,36 180 top
J3  77.8,33.75 180 top
J4  57,48.8 270 top
J5  69,48.8 270 top
J6  12.8,38 180 top
J7  45,44 0 top
J8  56.6,38 270 top
J9  56.6,34.2 270 top
J10  7,15 90 top
J11  21.59,6.35 90 top
J12  21.59,2.54 90 top
J13  15.8,31.6 90 top
J15  7,11 90 top
R1  30.6,17.6 270 top
R2  32.2,17.6 270 top
R3  4.4,35.6 270 top
R4  30.6,39.2 90 top
R5  10.2,24 270 top
R6  67.4,38.8 0 top
R7  70.6,38.8 0 top
R8  65,38 90 top
R9  73,38 90 top
R12  63.2,38 270 top
R13  63.2,34.8 270 top
R14  61.6,38 270 top
R15  61.6,34.8 270 top
R16  51.8,34.2 270 top
R17  51.8,38 270 top
R18  6,42 270 top
R19  6,35.6 270 top
R20  4.4,42 270 top
R22  26.4,44 90 top
R32  18,29.2 0 top
R33  14.2,11.6 0 top
R34  21,34.6 270 top
R35  19.4,34.6 270 top
R36  14.6,34.6 270 top
R37  13,34.6 270 top
R38  11.4,34.6 270 top
R41  32.2,39.2 90 top
R42  28,39.2 90 top
SW1  38,7.8 270 top
U1  18.8,21.6 0 top
U2  71,19.2 90 top
U5  31.4,42.6 0 top
U6  47.6,30 270 top
X1  4.8,25.8 270 top

### Tracks (layer width: path | path; a pad name or v marks a point on that pad's centre or on a via)
+3V3  (via drill 0.33)
  Top 0.6: FB2.1 v64.4,28 | v65,9.2 FB3.1 | FB4.1 v74.4,9.6 | FB1.1 v77.4,18 | v49.6,28.6 49.55,28.65 U6.5 48.55,26.65 v48.6,26.6 | v48.6,26.6 C33.2 | v48.6,26.6 v49.6,26.6 | FB9.1 v44.4,24.2 v45.6,24.2 v46.8,24.2 v48,24.2 48.6,24.8 v48.6,26.6
  other vias: 48.6,25.4
  pour Route15: 43,0 43,54 82,54 82,0
+5V_REG
  Top 1: J7.1 48.25,37.75 D2.A
+5V_USB
  Top 0.6: FB5.1 36,38.35 D1.A
+V
  Top 0.3: U6.1 48.55,30.35 48.2,30 47,30 46.65,30.35 U6.3
  Top 0.6: U6.1 48.55,33.35 C30.2 48.5,33.9 45.2,37.2 44.55,37.2 D2.C D1.C 40.8,37.6
CODEC_ADCDAT  (via drill 0.33)
  Top 0.3: U2.6 70.03,13.97 v70.4,13.6 | U1.36 27.85,19.35 28.8,18.4 v28.8,16.4
  Bottom 0.3: v70.4,13.6 70.4,12.2 69.2,11 63.6,11 58.2,16.4 v28.8,16.4
CODEC_AVDD
  Top 0.3: U2.14 75.22,13.97 C19.2
  Top 0.6: C19.2 77.3,13.6 C20.2 FB1.2
CODEC_BCLK  (via drill 0.33)
  Top 0.3: U2.3 68.08,14.47 67.6,14 67.6,13 v68.2,12.4 | U1.55 19.55,26.35 19.2,26 19.2,25.2 21.6,22.8 21.6,21 23.2,19.4 23.2,18.6 23.45,18.35 U1.34 26.65,18.35 v27,18
  Bottom 0.3: v68.2,12.4 63.8,12.4 58.2,18 v27,18
CODEC_DACDAT  (via drill 0.33)
  Top 0.3: U2.4 68.72,13.93 v68.4,13.6 | U1.57 18.55,25.05 21,22.6 21,20.2 v22.4,18.8
  Bottom 0.3: v68.4,13.6 65,13.6 59.8,18.8 v22.4,18.8
CODEC_DBVDD
  Top 0.3: U2.1 66.78,13.78 C21.2
  Top 0.6: C21.2 66.6,12.1 C24.2 66.7,12 FB3.2
CODEC_DCVDD
  Top 0.3: U2.27 67.42,24.57 C23.2 | 67.2,26.3 C22.2
  Top 0.6: C23.2 67.2,26.3 | FB2.2 67.3,26.4 C22.2
CODEC_HPVDD
  Top 0.3: U2.8 71.33,13.07 C25.2
  Top 0.6: C25.2 71.6,11.3 C26.2 71.5,11.2 FB4.2
CODEC_LHPOUT
  Top 0.3: U2.9 71.97,17.23 71,18.2 63.4,18.2 62.2,17 62.2,10 61.6,9.4 C13.1
CODEC_LLINEIN
  Top 0.3: U2.20 71.97,26.82 68.8,30 68.2,30 67.6,30.6 C6.1
CODEC_LOUT
  Top 0.3: U2.12 73.92,18.07 72,20 65.6,20 61.8,23.8 56.2,23.8 54.8,25.2 C11.1
CODEC_LRC  (via drill 0.33)
  Top 0.3: U2.7 70.67,16.93 70.4,17.2 69.6,17.2 69.38,16.98 U2.5 69.38,12.82 v69.4,12.8 | U1.20 16.55,17.55 17.2,18.2 21.8,18.2 22.15,17.85 U1.33 25.55,17.85 v26.2,17.2
  Bottom 0.3: v69.4,12.8 69.4,12 69,11.6 63.8,11.6 58.2,17.2 v26.2,17.2
CODEC_MCLK_IN  (via drill 0.33)
  Top 0.3: U2.25 68.72,24.07 v68.4,24.4 | U1.37 26.85,19.85 v28,21
  Bottom 0.3: v68.4,24.4 65.2,21.2 28.2,21.2 v28,21
CODEC_RHPOUT
  Top 0.3: U2.10 72.62,17.57 71.4,18.8 60.55,18.8 C14.1
CODEC_RLINEIN
  Top 0.3: U2.19 72.62,30.48 C5.1
CODEC_ROUT
  Top 0.3: U2.13 74.58,18.43 72.4,20.6 66,20.6 61.4,25.2 C12.1
CODEC_SCLK  (via drill 0.33)
  Top 0.3: U2.24 69.38,24.98 v69.4,25 | U1.61 16.55,26.25 20.2,22.6 v20.2,20.8 | v30.6,20.4 R1.1
  Bottom 0.3: v69.4,25 69.38,24.98 69.38,23.8 65.97,20.4 v30.6,20.4 28.6,20.4 28.4,20.2 23,20.2 22.4,20.8 v20.2,20.8
CODEC_SDI  (via drill 0.33)
  Top 0.3: U2.23 70.03,24.02 v70.4,24.4 | U1.62 16.05,25.95 19.4,22.6 19.4,20.4 v20.2,19.6 | v32.2,19.6 R2.1
  Bottom 0.3: v70.4,24.4 70.03,24.02 70.03,23.4 66.22,19.6 v32.2,19.6 v20.2,19.6
GND  (via drill 0.33)
  Top 0.5: U5.2 v28.8,42.6
  other vias: 29.4,45.2 26.4,42 24.8,42 37.2,44.4 65.6,23.6 68.8,28.2 64.4,24.8 53,35.4 53,39.2 53.2,50.6 51.2,52.4 55.4,52.4 63.2,52.4 67.4,52.4 65.2,50.6 65,14.8 63.8,13.6 68.2,10.2 66.8,8.8 70,9.4 71.4,8 74.4,13.2 73.2,14 75.6,10.8 77.4,10.4 74.4,11.6 76.6,23.6 75.8,21 76.2,22.6 77.8,24.8 78.2,26.6 76.8,28 71,25.4 68.4,17.4 67,17.4 65.6,17.4 65.6,16 76.2,16.6 75.6,18.4 74.6,19.8 73.4,21 76.2,14.8 66,29.4 64.4,35.6 64.4,34 63.2,32.8 61.6,40 63.2,40 68.2,40 69.8,40 69.8,36 17.8,34.2 18.3,38.8 11.2,38.8 10,37.4 26.6,28.6 28.2,28.8 21.2,41.6 22.4,49.6 8.9,50.8 7.2,52.6 28.2,45.2 27.6,44.2 45.4,33.4 46.2,34.8 45.4,32 23.6,43.2 11.8,29.2 24.6,15.2 25.8,14 26,12.2 24.6,10.8 14.2,12.8 14.2,15.2 15.6,17.4 14.5,19.55 16,28.8 7.4,28 8.6,29.2 7.4,23.2 8.4,21.4 30.2,37 30.2,35 30.2,33 30.2,31 30.2,29 32.6,37 32.6,35 32.6,33 32.6,31 32.6,29 32.6,27 30.2,27 13.6,10.4 18.2,30.4 41.4,15.4 41.4,22.2 31.6,22.2 27.2,31.2 39.4,22.2 37.4,22.2 35.4,22.2 33.4,22.2 39.4,15.4 37.4,15.4 35.4,15.4 33.4,15.4 31.4,14.6 30.2,13.4 30.2,11.4 30.2,9.4 27,16.2 27,14.2 27,10.2 27,8.2 43.6,22.2 45.6,22.2 47.6,22.2 49.6,22.2 43.6,15.4 45.6,15.4 47.6,15.4 49.6,15.4 41.4,26.2 41.4,28.2 41.4,30.2 41.4,32.2 41.4,34.2 41.4,40.2 43.6,26.2 43.6,28.2 43.6,30.2 43.6,32.2 43.6,34.2 43.6,36 43.6,11.4 38.8,12.2 41.4,9.4 43.6,9.4 43.6,7.4 41.4,7.4 41.4,5.4 43.6,5.4 43.6,3.4 38.8,3.4 41.4,1.4 43.6,1.4 41.4,46.2 41.4,48.2 41.4,50.2 41.4,52.2 43.6,50.2 43.6,52.2 43.6,44.2 39.4,52.8 37.4,52.8 36.4,49.8 37.4,46.2 37.4,48 24.6,48 24.6,46.2 25.6,49.8 24.2,52.6 1.4,33 1.4,31 1.4,29 1.4,27 1.4,25 1.4,23 1.4,21 1.4,19 1.4,17 1.4,13 1.4,9 1.4,15 1.4,11 1.4,35 1.4,37 1.4,39 1.4,41 1.4,43 1.4,45 1.4,47 14.2,52.6 16.2,52.6 18.2,52.6 20.2,52.6 8,1.4 39.4,1.4 37.4,1.4 35.4,1.4 3.2,39.6 3.2,46 10.8,18.4 4.8,17.4 3.6,25.8 6,25.8 6.8,32.6 7.4,41.4 7.4,43.6 7.4,46 8,39.2 8,37 10,35.2 10.2,32 13,30.6 12.2,32.6 15.8,25 18,22.8 21.4,17.4 24,38.2 3.4,9 5.4,9 7.4,9 9.4,9 11.4,9 8,3.4 8,5.4 8,7.4 31.6,8.2 33.6,8.2 33.6,24.2 27.4,37 27.4,35 45.6,1.4 47.6,1.4 49.6,1.4 51.6,1.4 53.6,1.4 55.6,1.4 57.6,1.4 59.6,1.4 61.6,1.4 63.6,1.4 65.6,1.4 67.6,1.4 69.6,1.4 71.6,1.4 73.6,1.4 63.6,10 63.2,7.6 61.2,7.6 59.2,7.6 57.2,7.6 55.2,7.6 53.2,7.6 51.2,7.6 51,9.6 49.6,11 49.6,13.2 73.4,8 75.6,8.6 41.4,36 35.2,25.8 43.6,13.4 45.4,52.8 47.4,52.8 49.4,52.8 61.6,52.8 59.6,52.8 70.6,52.6 72.6,52.6 74.6,52.6 80.6,47 80.6,45 80.6,43 80.6,41 80.6,39 80.6,37 80.6,35 80.6,33 80.6,31 80.6,29 80.6,27 80.6,25 80.6,23 80.6,21 80.6,19 80.6,17 80.6,15 80.6,13 80.6,11 80.6,9 73.8,3.4 74.2,5.4 75.4,7 77,8 79,8 79,46 77,46 75.4,47 74.2,48.4 63,50.2 63,48.2 63,46.2 63,44.2 63,42.2 51,50.2 51,48.2 51,46.2 51,44.2 51,42.2 51,40.2 50.4,38.4 49.8,34.6 49.8,32.6 49.8,30.6 50,36.6 49.6,24.2
  pour Top (rank 2): 42,54 42,0 0,0 0,54
  pour Route2: 0,0 0,54 82,54 82,0
  pour Top (rank 2): 43,0 43,54 82,54 82,0
  pour Bottom: 0,0 0,54 42,54 42,0
  pour Bottom: 43,0 43,54 82,54 82,0
HEADPHONE_OUT_L
  Top 0.3: J8.3 52.8,38 52,37.2 R17.2 50.8,36.2 50.8,11.4 52.8,9.4 C13.2
HEADPHONE_OUT_R
  Top 0.3: C14.2 52.8,19 51.8,20 R16.2 52,33.4 52.8,34.2 J9.3
LINE_IN_L
  Top 0.3: J5.2 65.3,39.1 R8.2
LINE_IN_R
  Top 0.3: J5.3 72.7,39.1 R9.2
LINE_OUT_L
  Top 0.3: R14.1 61.4,38.6 59.74,38.6 J8.1
LINE_OUT_R
  Top 0.3: R15.1 61.4,35.4 60.34,35.4 J9.1
MCU_BOOT0
  Top 0.3: U1.60 17.05,29.05 R32.1 17.07,29.33 J13.2
MCU_BOOT1  (via drill 0.33)
  Top 0.3: R33.2 v16.2,11.6 | U1.28 20.55,17.05 20.2,17.4 v17.5,17.4
  Bottom 0.3: v17.5,17.4 17.5,12.9 v16.2,11.6
MCU_JTCK/SWCLK
  Top 0.3: J2.3 24.2,35.87 24.2,29 23.1,27.9 22.6,27.9 22.55,27.85 U1.49
MCU_JTMS/SWDIO
  Top 0.3: U1.46 28.75,24.35 29.4,25 29.4,30.93 J2.2
MCU_OSC_IN
  Top 0.3: U1.5 11.65,23.35 11.2,23.8 11.2,25.6 11,25.8 9.2,25.8 C3.2 6.8,26.4 4.8,28.4 X1.1
MCU_OSC_OUT
  Top 0.3: U1.6 10.55,22.85 R5.2
MCU_PA0
  Top 0.3: U1.14 12.05,18.85 11.8,18.6 11.8,17.32 11.6,17.12 7.85,17.12 J10.2
MCU_PA1
  Top 0.3: U1.15 14.05,18.35 14.4,18 14.4,17.52 12.23,15.35 12.23,13.83 11.4,13 7.73,13 J15.2
MCU_PA2
  Top 0.3: U1.16 12.6,17.85 12.6,17.12 12,16.52 9.79,16.52 J10.3
MCU_PA3
  Top 0.3: U1.17 15.05,16 13.6,16 12.8,15.2 12.8,13.6 11.6,12.4 9.67,12.4 J15.3
MCU_PA5
  Top 0.3: U1.21 17.05,11.25 13.4,7.6 12,7.6 11.43,7.03 11.43,3.81 J12.2
MCU_PA6
  Top 0.3: U1.22 17.55,10.55 13.97,6.97 13.97,3.81 J12.3
MCU_PA7
  Top 0.3: U1.23 18.05,8.45 16.51,6.91 16.51,3.81 J12.4
MCU_PB0
  Top 0.3: J11.6 22.86,6.54 19.55,9.85 U1.26
MCU_PB1
  Top 0.3: J12.7 24.13,3.81 24.13,7.02 20.05,11.1 U1.27
MCU_PB10
  Top 0.3: U1.29 21.05,10.95 25.4,6.6 J11.7
MCU_PB11
  Top 0.3: U1.30 21.55,11.25 25.2,7.6 26,7.6 26.67,6.93 26.67,3.81 J12.8
MCU_PB14
  Top 0.3: U1.35 27.35,18.85 27.94,18.26 J11.8
MCU_PC0  (via drill 0.33)
  Top 0.3: U1.8 17.95,21.85 v18.6,21.2
  Bottom 0.3: v18.6,21.2 18.6,18.4 19,18 19,7.67 J11.5
MCU_PC1  (via drill 0.33)
  Top 0.3: U1.9 17.05,21.35 v17.6,20.8
  Bottom 0.3: v17.6,20.8 17.6,18.6 18.4,17.8 18.4,6.97 J11.4
MCU_PC2  (via drill 0.33)
  Top 0.3: U1.10 16.15,20.85 v16.6,20.4
  Bottom 0.3: v16.6,20.4 16.6,14.6 15.04,13.04 15.04,12.36 15.24,12.16 J11.3
MCU_PC3  (via drill 0.33)
  Top 0.3: U1.11 15.25,20.35 v15.6,20
  Bottom 0.3: v15.6,20 15.6,19.2 12.7,16.3 J11.2
MCU_PC4
  Top 0.3: U1.24 18.55,7.52 19.05,7.02 19.05,3.81 J12.5
MCU_PC5
  Top 0.3: J12.6 21.59,3.81 21.59,7.02 19.05,9.56 U1.25
MCU_PC7
  Top 0.3: U1.38 26.15,20.35 27.6,21.8 28.4,21.8 29.6,20.6 29.6,16 29.21,15.61 29.21,3.81 J12.9
MCU_RESET#  (via drill 0.33)
  Top 0.3: U1.7 14.15,22.35 v14.6,22.8 | v22.2,25 25.6,28.4 C29.2 J2.1 | SW1.4 SW1.3 35.65,12.4 v34.4,12.4
  Bottom 0.3: v14.6,22.8 16,24.2 19.4,24.2 | 19.4,24.2 21.4,24.2 v22.2,25 | v34.4,12.4 29.6,12.4 29.2,12.8 29.2,13.4 27.4,15.2 26,15.2 24.6,16.6 20.4,16.6 19.6,17.4 19.6,18.4 19.4,18.6 19.4,24.2
MCU_SDIO_CK  (via drill 0.33)
  Top 0.3: v17.2,38.8 J6.5 | U1.53 20.55,26.15 v20,25.6
  Bottom 0.3: v17.2,38.8 22.4,33.6 22.4,28 v20,25.6
MCU_SDIO_CMD  (via drill 0.33)
  Top 0.3: v15,38.8 J6.3 15,35.8 R36.1 | U1.54 20.05,28.65 v20.4,29
  Bottom 0.3: v20.4,29 20.4,33.4 v15,38.8
MCU_SDIO_D0  (via drill 0.33)
  Top 0.3: v19.4,38.8 J6.7 R35.1 | U1.39 23.15,20.85 22.2,21.8 v22.2,23.8
  Bottom 0.3: v22.2,23.8 23,24.6 23,35.2 v19.4,38.8
MCU_SDIO_D1  (via drill 0.33)
  Top 0.3: U1.40 23.45,21.35 23,21.8 v23,22.8 | v20.5,38.8 J6.8 20.5,35.9 R34.1
  Bottom 0.3: v23,22.8 23.6,23.4 23.6,35.7 v20.5,38.8
MCU_SDIO_D2  (via drill 0.33)
  Top 0.3: v12.8,38.8 J6.1 12.8,37.15 12.6,36.95 12.6,36.6 R38.1 | U1.51 21.55,25.95 v21.2,25.6
  Bottom 0.3: v21.2,25.6 20.4,24.8 19.6,24.8 19.2,25.2 19.2,31.6 17,33.8 17,34.6 v12.8,38.8
MCU_SDIO_D3  (via drill 0.33)
  Top 0.3: v13.9,38.8 J6.2 13.9,36.3 R37.1 | U1.52 21.05,28.45 v21.6,29
  Bottom 0.3: v13.9,38.8 14.7,39.6 15.5,39.6 16,39.1 16,38.6 21.6,33 v21.6,29
MCU_USB_DM
  Top 0.3: U1.44 29.35,23.35 31.7,25.7 31.7,37.9 R41.1
MCU_USB_DP
  Top 0.3: U1.45 29.05,23.85 31.1,25.9 31.1,37.9 R4.1
MCU_USB_ID  (via drill 0.33)
  Top 0.3: v29.4,38.4 R42.1 | U1.43 30.05,22.85 33.8,26.6 v33.8,38.4
  Bottom 0.3: v33.8,38.4 v29.4,38.4
MCU_VDD  (via drill 0.33)
  Top 0.3: U1.48 25.95,25.35 C42.2 | U1.64 15.05,28.75 C43.2 | U1.32 22.55,14.45 C37.2 | U1.1 12.6,25.35 v12.6,26.2 | R1.2 v30.6,15.6 | R2.2 v32.2,15.6 | U1.13 11.65,19.35 C34.2 | U1.19 16.05,14.05 C36.2 | R20.2 v3.2,41.2
  Top 0.6: J6.4 16.1,35.5 C28.2 v16.2,34.2 | R38.2 R37.2 R36.2 15.8,33.8 v16.2,34.2 | R34.2 R35.2 18.8,33.2 17.2,33.2 v16.2,34.2 | v25.2,26.2 26,26.2 C42.2 | C43.2 14.2,28.8 v14.2,28 | C37.2 23.4,14.4 v23.4,15.2 | C36.2 v16,12.8 | C38.2 v8.4,19.8 C34.2 | FB9.2 v40.6,24.2 v39.4,24.2 v38.2,24.2 C35.2
  pour Route15: 0,0 0,54 42,54 42,0
N$1
  Top 0.3: U1.4 11.95,23.85 11.8,24 11.8,25.8 9.8,27.8 9.8,29.4 8,31.2 8,33.6 7.7,33.9 5.3,33.9 R3.2
N$2
  Top 0.3: U1.3 14.35,24.35 15,25 15,25.8 13.2,27.6 12,27.6 11,28.6 11,29.8 9.2,31.6 9.2,34.4 7,36.6 7,40.2 R18.2
N$3
  Top 0.3: U1.2 14.05,24.85 14.4,25.2 14.4,25.6 13,27 11.8,27 10.4,28.4 10.4,29.6 8.6,31.4 8.6,33.8 7.6,34.8 R19.2
N$6
  Top 0.3: C27.2 45.2,29.2 45.4,29 46.65,29 U6.4
N$7
  Top 0.3: R19.1 D3.A
N$9
  Top 0.3: U2.17 73.92,27.32 74.6,28 74.6,28.01 J3.1
N$10
  Top 0.3: R5.1 C4.2 6.4,24.8 4.8,23.2 X1.2
N$11
  Top 0.3: J1.2 31.7,46.75 31.7,43.55 | 31.7,43.55 U5.6 | 31.7,43.55 31.7,40.5 R41.2
N$13
  Top 0.3: R18.1 D4.A
N$14
  Top 0.3: R3.1 D5.A
N$15
  Top 0.3: J1.3 31.1,46.75 31.1,43.55 | 31.1,43.55 U5.1 | R4.2 31.1,40.5 31.1,43.55
N$16
  Top 0.3: U1.47 27.35,24.85 C40.1
N$17
  Top 0.3: R20.1 D6.A
N$18
  Top 0.3: U2.18 73.28,27.68 76.4,30.8 76.4,34.89 J3.3
N$20
  Top 0.3: R7.2 C8.2 R9.1 73,34.75 C5.2
N$21
  Top 0.3: C7.1 R6.1 | C7.1 R8.1 | C7.1 66.6,36.2 67.6,35.2 C6.2
N$23
  Top 0.3: U1.31 22.05,13.25 22.9,12.4 C41.2
N$29
  Top 0.3: C11.2 54.8,31 56.6,32.8 57.2,32.8 57.85,33.45 57.85,34.85 59.2,36.2 60.6,36.2 R14.2 R12.2
N$30
  Top 0.3: C12.2 61.6,30.65 R15.2 R13.2
N$41
  Top 0.3: U2.16 74.58,24.38 C17.2
  Top 0.6: C17.2 75,26.5 C18.2
OUT_L
  Top 0.3: J8.2 56.6,39.7 J4.2
OUT_R
  Top 0.3: J9.2 56.6,35.6 57.85,36.85 57.85,38.65 59.6,40.4 59.6,49.6 60.4,50.4 J4.3
SDIO_CARD_DETECT  (via drill 0.33)
  Top 0.3: v23,37.4 J6.SW@1 | U1.41 25.55,21.85 v26,21.4
  Bottom 0.3: v23,37.4 24.2,36.2 24.2,23.2 v26,21.4
USB_ID
  Top 0.3: J1.4 30.2,44.6 30,44.4 29.2,44.4 28,43.2 28,41.65 | R42.2 28,41.65 | 28,41.65 U5.3
USB_SHIELD  (1 unrouted)
  Top 0.5: C31.2 R22.2 26.4,46.7 J1.SHIELD@4 J1.SHIELD@3 | J1.SHIELD@2 J1.SHIELD@1
VBUS
  Top 0.3: FB5.2 34.2,42.6 34.2,41.2 34.6,40.8 34.6,26.6 30.35,22.35 U1.42
  Top 0.5: J1.1 32.6,45.4 33.35,44.65 34.2,44.65 34.4,44.45 C16.2 FB5.2 34.25,42.65 33,42.65 32.95,42.6 U5.5